# Altium schematic sheet RGBKeyFob.SchDoc
size A3; SheetNumber: 2; SheetTotal: 9
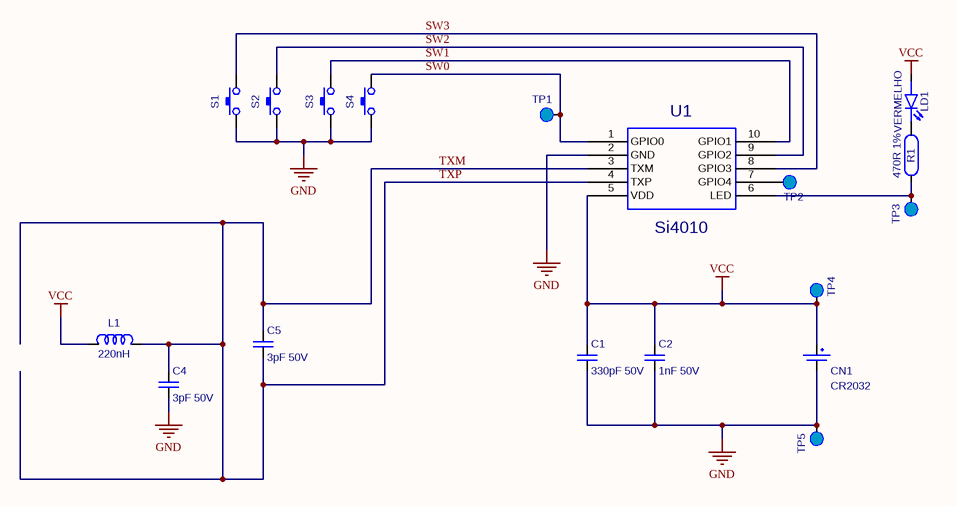
[diagram p0: RGBKeyFob.SchDoc]

## Parts
C1  value 330pF 50V  [C0805]  (hidden comment: 270pF 50V)
C2  1nF 50V  [C0805]
C4  3pF 50V  [C0805]
C5  3pF 50V  [C0805]
CN1  value CR2032  [CR2032 LINX]  (hidden comment: CR2032 LINX)
L1  220nH  [I0805]
LD1  VERMELHO  [LED3MM-RED]
R1  470R 1%  [R0805]
S1  TECLA SMD 4,3mm  [TECLA_TS-06M-ASM]  (value not drawn)
S2  TECLA SMD 4,3mm  [TECLA_TS-06M-ASM]  (value not drawn)
S3  TECLA SMD 4,3mm  [TECLA_TS-06M-ASM]  (value not drawn)
S4  TECLA SMD 4,3mm  [TECLA_TS-06M-ASM]  (value not drawn)
TP1  TestPoint SMD  [TestPointSMD]  (value not drawn)
TP2  TestPoint SMD  [TestPointSMD]  (value not drawn)
TP3  TestPoint SMD  [TestPointSMD]  (value not drawn)
TP4  TestPoint SMD  [TestPointSMD]  (value not drawn)
TP5  TestPoint SMD  [TestPointSMD]  (value not drawn)
U1  Si4010  [MSOP-10]

## Nets
GND: C1.2 C2.2 C4.2 CN1.2 S1.2 S2.2 S3.2 S4.2 TP5.1 U1.2(GND)
VCC: C1.1 C2.1 CN1.1 L1.1 LD1.1(anode) TP4.1 U1.5(VDD)
SW0: S4.1 TP1.1 U1.1(GPIO0)
SW1: S3.1 U1.10(GPIO1)
SW2: S2.1 U1.9(GPIO2)
SW3: S1.1 U1.8(GPIO3)
TXM: C4.1 C5.1 C5.2 L1.2 U1.3(TXM) U1.4(TXP)  [also labelled TXP]
NetLD1_2: LD1.2(cathode) R1.2
NetR1_1: R1.1 TP3.1 U1.6(LED)
NetTP2_1: TP2.1 U1.7(GPIO4)

## Notes on the sheet
- Aplicação:
- Cod. SC:
- PCI:
- Documento: EE-
- Rev. PCI:
- Rev.EE:
- Data:
- Cod. PCI:
- Projetista:
- Aprovado por:
- Pg:
- /

## Library data of the parts
C1 = CC 270pF 50V 0805: Part Number: 08055A271JAT2A; REFERENCIA: ????; ENCAPSULAMENTO: C0805; ModifyDate: ???
C2 = CC 1nF 50V 0805: REFERENCIA: 003.05.006; ENCAPSULAMENTO: C0805; ModifyDate: 05/27/2015 14:07:26; Value: 1nF 50V
C4 C5 = CC 3pF 50V 0805: Part Number: 08055A3R0CAT2A; REFERENCIA: ????; ENCAPSULAMENTO: C0805; ModifyDate: ????; Value: 3pF 50V
CN1 = SUPORTE BAT CR2032 LINX: Part Number: BAT-HLD-001; REFERENCIA: ????; ENCAPSULAMENTO: CR2032; ModifyDate: ????????
L1 = IND 220nH 0805 SMD: Part Number: CE201210-R22J; REFERENCIA: ???; ENCAPSULAMENTO: *; ModifyDate: ???; Value: 220nH
LD1 = LED VM 3MM: LED SMT 0805; ENCAPSULAMENTO: PTH; Part Number: *; REFERENCIA: 006.05.002; ModifyDate: 05/27/2015 14:07:26; Value: VERMELHO
R1 = RES 470R 1% 0805: Part Number: {Part Number}; REFERENCIA: 002.05.025; ENCAPSULAMENTO: R0805; ModifyDate: 05/27/2015 14:07:26; Value: 470R 1%
S1-S4 = TEC TACTIL 4,3MM SMD: TECLA TACTIL 4,3MM SMD; Value: TECLA SMD 4,3mm; REFERENCIA: 051.00.003; ENCAPSULAMENTO: SMD; ModifyDate: 05/27/2015 14:07:26
TP1-TP5 = TestPoint SMD: REFERENCIA: ????; ENCAPSULAMENTO: ???; Value: TP SMD; ModifyDate: ????????; Part Number: ????
U1 = CI Si4010-C2-GT MSOP-10: REFERENCIA: ???; Part Number: Si4010-C2-GT; Value: Si4010; ENCAPSULAMENTO: MSOP-10; ModifyDate: ???